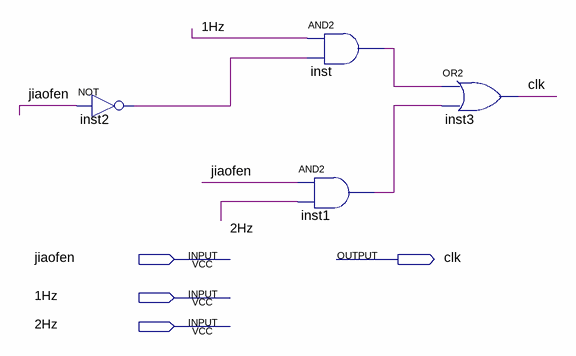
[diagram p0: schematic sheet]
// Quartus schematic jiaofen.bdf as structural Verilog: 4 symbols, 4 pins
module jiaofen (
  input  jiaofen,
  input  \1Hz ,
  input  \2Hz ,
  output clk
);

  wire inst1_out, inst2_out, inst_out;

  not inst2 (inst2_out, jiaofen);
  and inst (inst_out, \1Hz , inst2_out);
  and inst1 (inst1_out, jiaofen, \2Hz );
  or inst3 (clk, inst_out, inst1_out);
endmodule
